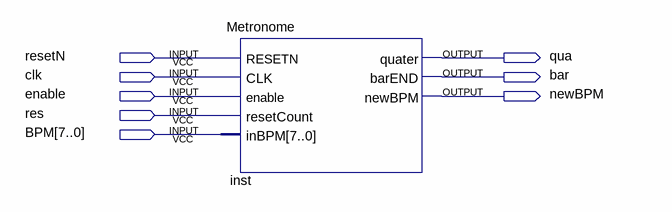
[diagram p0: schematic sheet]
// Quartus schematic Met_block_exp.bdf as structural Verilog: 1 symbols, 8 pins
module Met_block_exp (
  input  resetN,
  input  clk,
  input  enable,
  input  res,
  input  [7:0] BPM,
  output qua,
  output bar,
  output newBPM
);

  Metronome inst (
    .RESETN(resetN), .CLK(clk), .enable(enable), .resetCount(res), .inBPM(BPM), .quater(qua), .barEND(bar),
    .newBPM(newBPM));
endmodule
